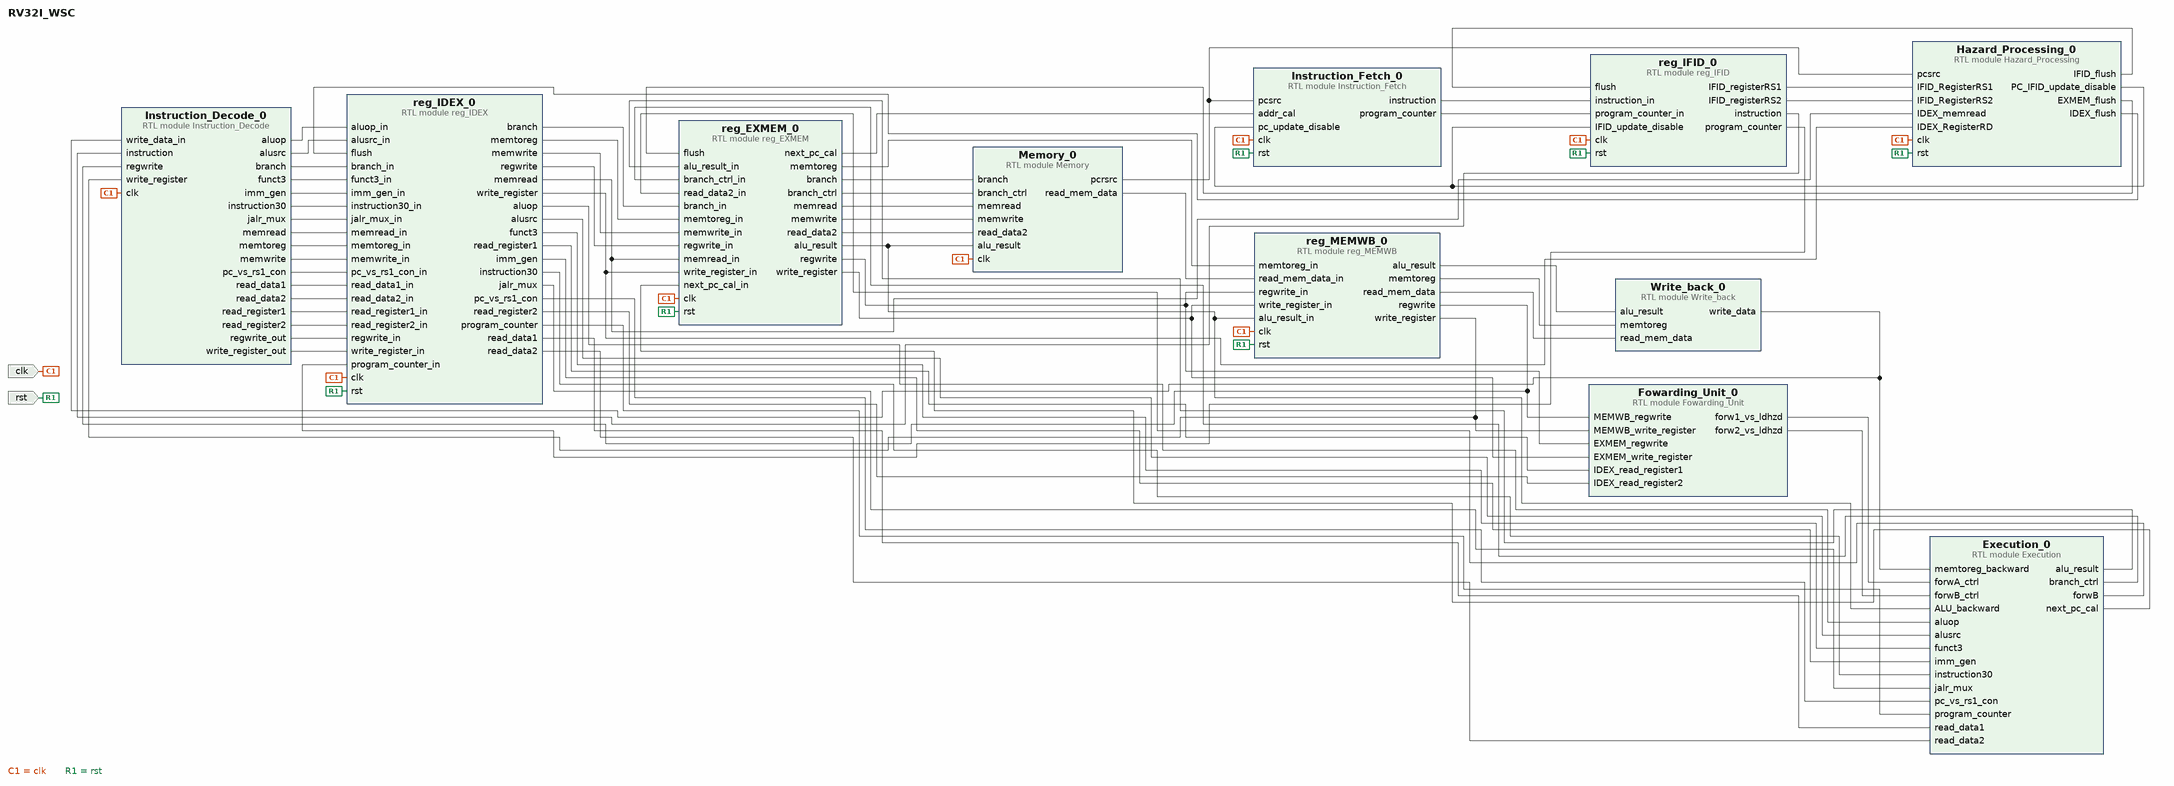
[diagram p0: block diagram of the top level]
# Vivado block design RV32I_WSC, xc7z007sclg400-1, Vivado 2024.1
create_bd_design RV32I_WSC

create_bd_port -dir I clk
create_bd_port -dir I rst

create_bd_cell -type module -reference Instruction_Fetch Instruction_Fetch_0
create_bd_cell -type module -reference Instruction_Decode Instruction_Decode_0
create_bd_cell -type module -reference reg_IFID reg_IFID_0
create_bd_cell -type module -reference reg_IDEX reg_IDEX_0
create_bd_cell -type module -reference Execution Execution_0
create_bd_cell -type module -reference reg_EXMEM reg_EXMEM_0
create_bd_cell -type module -reference Memory Memory_0
create_bd_cell -type module -reference reg_MEMWB reg_MEMWB_0
create_bd_cell -type module -reference Write_back Write_back_0
create_bd_cell -type module -reference Hazard_Processing Hazard_Processing_0
create_bd_cell -type module -reference Fowarding_Unit Fowarding_Unit_0

# ---- connections ----

connect_bd_net [get_bd_pins Execution_0/alu_result] [get_bd_pins reg_EXMEM_0/alu_result_in]
connect_bd_net [get_bd_pins Execution_0/branch_ctrl] [get_bd_pins reg_EXMEM_0/branch_ctrl_in]
connect_bd_net [get_bd_pins Execution_0/forwB] [get_bd_pins reg_EXMEM_0/read_data2_in]
connect_bd_net [get_bd_pins Execution_0/next_pc_cal] [get_bd_pins reg_EXMEM_0/next_pc_cal_in]
connect_bd_net [get_bd_pins Fowarding_Unit_0/forw1_vs_ldhzd] [get_bd_pins Execution_0/forwA_ctrl]
connect_bd_net [get_bd_pins Fowarding_Unit_0/forw2_vs_ldhzd] [get_bd_pins Execution_0/forwB_ctrl]
connect_bd_net [get_bd_pins Hazard_Processing_0/EXMEM_flush] [get_bd_pins reg_EXMEM_0/flush]
connect_bd_net [get_bd_pins Hazard_Processing_0/IDEX_flush] [get_bd_pins reg_IDEX_0/flush]
connect_bd_net [get_bd_pins Hazard_Processing_0/IFID_flush] [get_bd_pins reg_IFID_0/flush]
connect_bd_net [get_bd_pins Hazard_Processing_0/PC_IFID_update_disable] \
  [get_bd_pins Instruction_Fetch_0/pc_update_disable] [get_bd_pins reg_IFID_0/IFID_update_disable]
connect_bd_net [get_bd_pins Instruction_Decode_0/aluop] [get_bd_pins reg_IDEX_0/aluop_in]
connect_bd_net [get_bd_pins Instruction_Decode_0/alusrc] [get_bd_pins reg_IDEX_0/alusrc_in]
connect_bd_net [get_bd_pins Instruction_Decode_0/branch] [get_bd_pins reg_IDEX_0/branch_in]
connect_bd_net [get_bd_pins Instruction_Decode_0/funct3] [get_bd_pins reg_IDEX_0/funct3_in]
connect_bd_net [get_bd_pins Instruction_Decode_0/imm_gen] [get_bd_pins reg_IDEX_0/imm_gen_in]
connect_bd_net [get_bd_pins Instruction_Decode_0/instruction30] [get_bd_pins reg_IDEX_0/instruction30_in]
connect_bd_net [get_bd_pins Instruction_Decode_0/jalr_mux] [get_bd_pins reg_IDEX_0/jalr_mux_in]
connect_bd_net [get_bd_pins Instruction_Decode_0/memread] [get_bd_pins reg_IDEX_0/memread_in]
connect_bd_net [get_bd_pins Instruction_Decode_0/memtoreg] [get_bd_pins reg_IDEX_0/memtoreg_in]
connect_bd_net [get_bd_pins Instruction_Decode_0/memwrite] [get_bd_pins reg_IDEX_0/memwrite_in]
connect_bd_net [get_bd_pins Instruction_Decode_0/pc_vs_rs1_con] [get_bd_pins reg_IDEX_0/pc_vs_rs1_con_in]
connect_bd_net [get_bd_pins Instruction_Decode_0/read_data1] [get_bd_pins reg_IDEX_0/read_data1_in]
connect_bd_net [get_bd_pins Instruction_Decode_0/read_data2] [get_bd_pins reg_IDEX_0/read_data2_in]
connect_bd_net [get_bd_pins Instruction_Decode_0/read_register1] [get_bd_pins reg_IDEX_0/read_register1_in]
connect_bd_net [get_bd_pins Instruction_Decode_0/read_register2] [get_bd_pins reg_IDEX_0/read_register2_in]
connect_bd_net [get_bd_pins Instruction_Decode_0/regwrite_out] [get_bd_pins reg_IDEX_0/regwrite_in]
connect_bd_net [get_bd_pins Instruction_Decode_0/write_register_out] [get_bd_pins reg_IDEX_0/write_register_in]
connect_bd_net [get_bd_pins Instruction_Fetch_0/instruction] [get_bd_pins reg_IFID_0/instruction_in]
connect_bd_net [get_bd_pins Instruction_Fetch_0/program_counter] [get_bd_pins reg_IFID_0/program_counter_in]
connect_bd_net [get_bd_pins Memory_0/pcrsrc] [get_bd_pins Instruction_Fetch_0/pcsrc] [get_bd_pins Hazard_Processing_0/pcsrc]
connect_bd_net [get_bd_pins Memory_0/read_mem_data] [get_bd_pins reg_MEMWB_0/read_mem_data_in]
connect_bd_net [get_bd_ports clk] \
  [get_bd_pins Memory_0/clk] [get_bd_pins reg_MEMWB_0/clk] [get_bd_pins Instruction_Decode_0/clk] \
  [get_bd_pins Instruction_Fetch_0/clk] [get_bd_pins reg_IDEX_0/clk] [get_bd_pins reg_IFID_0/clk] \
  [get_bd_pins Hazard_Processing_0/clk] [get_bd_pins reg_EXMEM_0/clk]
connect_bd_net [get_bd_ports rst] \
  [get_bd_pins reg_MEMWB_0/rst] [get_bd_pins Instruction_Fetch_0/rst] [get_bd_pins reg_IDEX_0/rst] \
  [get_bd_pins reg_IFID_0/rst] [get_bd_pins Hazard_Processing_0/rst] [get_bd_pins reg_EXMEM_0/rst]
connect_bd_net [get_bd_pins Write_back_0/write_data] [get_bd_pins Instruction_Decode_0/write_data_in] [get_bd_pins Execution_0/memtoreg_backward]
connect_bd_net [get_bd_pins reg_EXMEM_0/alu_result] \
  [get_bd_pins Memory_0/alu_result] [get_bd_pins reg_MEMWB_0/alu_result_in] [get_bd_pins Execution_0/ALU_backward]
connect_bd_net [get_bd_pins reg_EXMEM_0/branch] [get_bd_pins Memory_0/branch]
connect_bd_net [get_bd_pins reg_EXMEM_0/branch_ctrl] [get_bd_pins Memory_0/branch_ctrl]
connect_bd_net [get_bd_pins reg_EXMEM_0/memread] [get_bd_pins Memory_0/memread]
connect_bd_net [get_bd_pins reg_EXMEM_0/memtoreg] [get_bd_pins reg_MEMWB_0/memtoreg_in]
connect_bd_net [get_bd_pins reg_EXMEM_0/memwrite] [get_bd_pins Memory_0/memwrite]
connect_bd_net [get_bd_pins reg_EXMEM_0/next_pc_cal] [get_bd_pins Instruction_Fetch_0/addr_cal]
connect_bd_net [get_bd_pins reg_EXMEM_0/read_data2] [get_bd_pins Memory_0/read_data2]
connect_bd_net [get_bd_pins reg_EXMEM_0/regwrite] [get_bd_pins reg_MEMWB_0/regwrite_in] [get_bd_pins Fowarding_Unit_0/EXMEM_regwrite]
connect_bd_net [get_bd_pins reg_EXMEM_0/write_register] \
  [get_bd_pins reg_MEMWB_0/write_register_in] [get_bd_pins Fowarding_Unit_0/EXMEM_write_register]
connect_bd_net [get_bd_pins reg_IDEX_0/aluop] [get_bd_pins Execution_0/aluop]
connect_bd_net [get_bd_pins reg_IDEX_0/alusrc] [get_bd_pins Execution_0/alusrc]
connect_bd_net [get_bd_pins reg_IDEX_0/branch] [get_bd_pins reg_EXMEM_0/branch_in]
connect_bd_net [get_bd_pins reg_IDEX_0/funct3] [get_bd_pins Execution_0/funct3]
connect_bd_net [get_bd_pins reg_IDEX_0/imm_gen] [get_bd_pins Execution_0/imm_gen]
connect_bd_net [get_bd_pins reg_IDEX_0/instruction30] [get_bd_pins Execution_0/instruction30]
connect_bd_net [get_bd_pins reg_IDEX_0/jalr_mux] [get_bd_pins Execution_0/jalr_mux]
connect_bd_net [get_bd_pins reg_IDEX_0/memread] [get_bd_pins Hazard_Processing_0/IDEX_memread] [get_bd_pins reg_EXMEM_0/memread_in]
connect_bd_net [get_bd_pins reg_IDEX_0/memtoreg] [get_bd_pins reg_EXMEM_0/memtoreg_in]
connect_bd_net [get_bd_pins reg_IDEX_0/memwrite] [get_bd_pins reg_EXMEM_0/memwrite_in]
connect_bd_net [get_bd_pins reg_IDEX_0/pc_vs_rs1_con] [get_bd_pins Execution_0/pc_vs_rs1_con]
connect_bd_net [get_bd_pins reg_IDEX_0/program_counter] [get_bd_pins Execution_0/program_counter]
connect_bd_net [get_bd_pins reg_IDEX_0/read_data1] [get_bd_pins Execution_0/read_data1]
connect_bd_net [get_bd_pins reg_IDEX_0/read_data2] [get_bd_pins Execution_0/read_data2]
connect_bd_net [get_bd_pins reg_IDEX_0/read_register1] [get_bd_pins Fowarding_Unit_0/IDEX_read_register1]
connect_bd_net [get_bd_pins reg_IDEX_0/read_register2] [get_bd_pins Fowarding_Unit_0/IDEX_read_register2]
connect_bd_net [get_bd_pins reg_IDEX_0/regwrite] [get_bd_pins reg_EXMEM_0/regwrite_in]
connect_bd_net [get_bd_pins reg_IDEX_0/write_register] [get_bd_pins Hazard_Processing_0/IDEX_RegisterRD] [get_bd_pins reg_EXMEM_0/write_register_in]
connect_bd_net [get_bd_pins reg_IFID_0/IFID_registerRS1] [get_bd_pins Hazard_Processing_0/IFID_RegisterRS1]
connect_bd_net [get_bd_pins reg_IFID_0/IFID_registerRS2] [get_bd_pins Hazard_Processing_0/IFID_RegisterRS2]
connect_bd_net [get_bd_pins reg_IFID_0/instruction] [get_bd_pins Instruction_Decode_0/instruction]
connect_bd_net [get_bd_pins reg_IFID_0/program_counter] [get_bd_pins reg_IDEX_0/program_counter_in]
connect_bd_net [get_bd_pins reg_MEMWB_0/alu_result] [get_bd_pins Write_back_0/alu_result]
connect_bd_net [get_bd_pins reg_MEMWB_0/memtoreg] [get_bd_pins Write_back_0/memtoreg]
connect_bd_net [get_bd_pins reg_MEMWB_0/read_mem_data] [get_bd_pins Write_back_0/read_mem_data]
connect_bd_net [get_bd_pins reg_MEMWB_0/regwrite] [get_bd_pins Fowarding_Unit_0/MEMWB_regwrite] [get_bd_pins Instruction_Decode_0/regwrite]
connect_bd_net [get_bd_pins reg_MEMWB_0/write_register] \
  [get_bd_pins Fowarding_Unit_0/MEMWB_write_register] [get_bd_pins Instruction_Decode_0/write_register]

validate_bd_design
save_bd_design
